# Altium project PCB_Project.PrjPcb
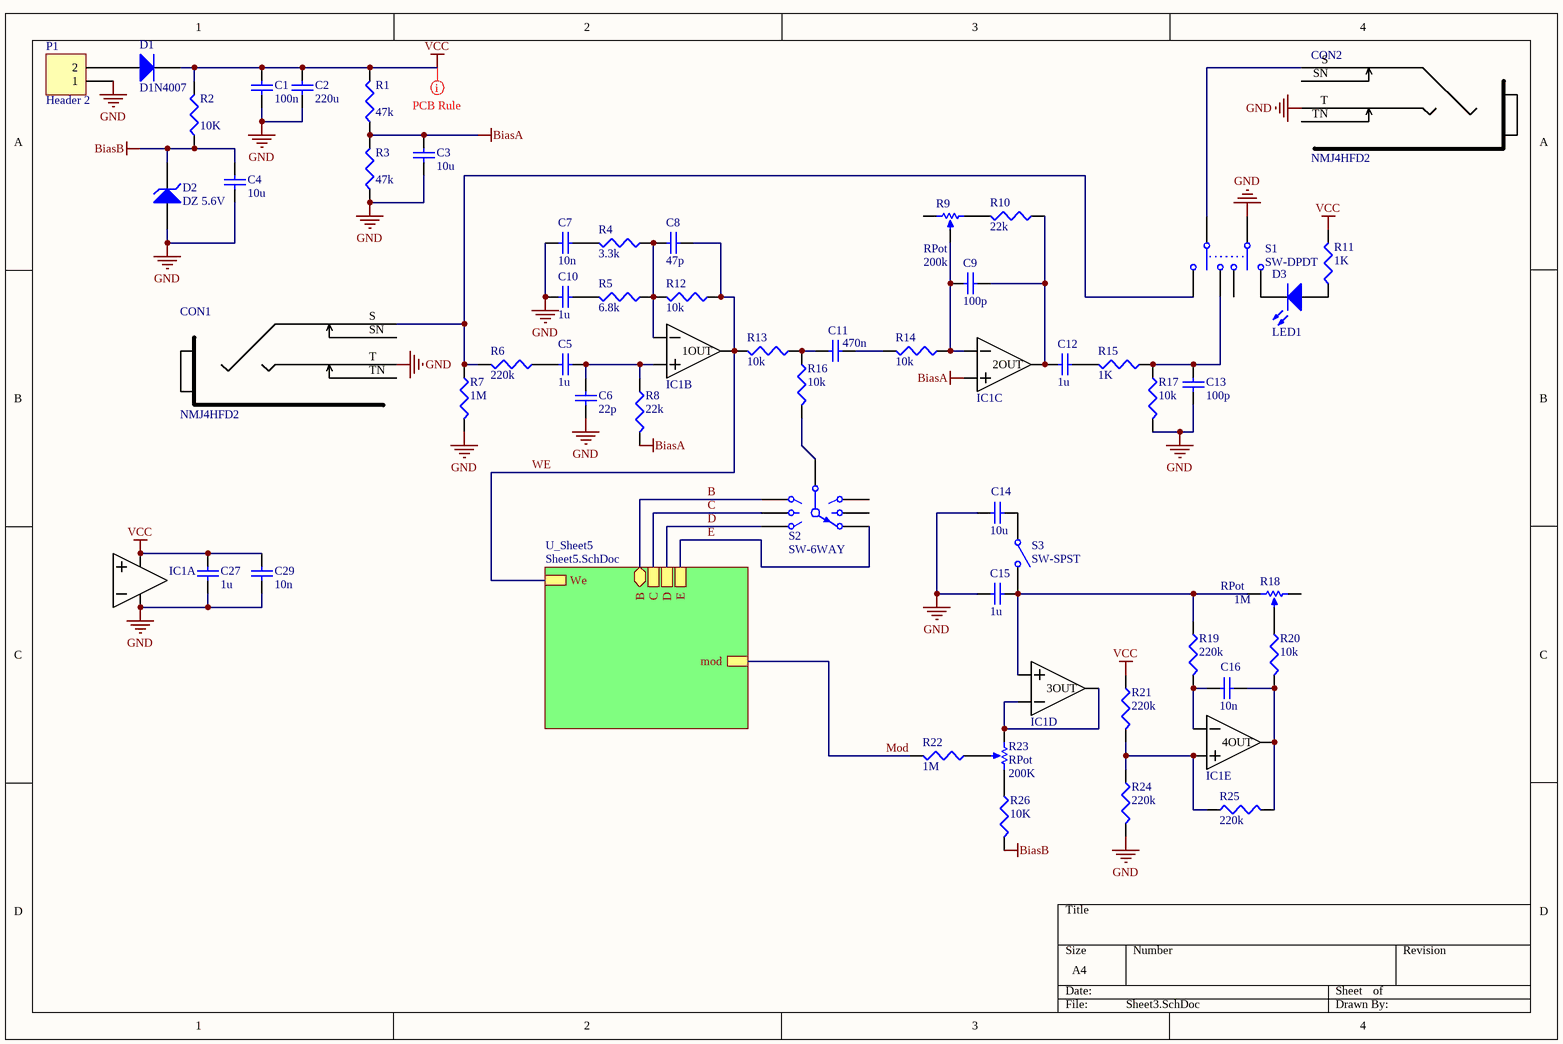
[diagram p0: Sheet3.SchDoc]
2 sheets, 93 parts. Net scope: hierarchical (ports join the sheet entries above them; power ports are global).
Board file: PCB1.PcbDoc
Sheets:
  Sheet3.SchDoc
    U_Sheet5 = Sheet5.SchDoc

## Sheet Sheet3.SchDoc
size A4

### Parts
C1  value 100n  [C1206]  (hidden comment: Cap Semi)
C2  value 220u  [C1206]  (hidden comment: Cap Semi)
C3  value 10u  [C1206]  (hidden comment: Cap Semi)
C4  value 10u  [C1206]  (hidden comment: Cap Semi)
C5  value 1u  [C1206]  (hidden comment: Cap Semi)
C6  value 22p  [C1206]  (hidden comment: Cap Semi)
C7  value 10n  [C1206]  (hidden comment: Cap Semi)
C8  value 47p  [C1206]  (hidden comment: Cap Semi)
C9  value 100p  [C1206]  (hidden comment: Cap Semi)
C10  value 1u  [C1206]  (hidden comment: Cap Semi)
C11  value 470n  [C1206]  (hidden comment: Cap Semi)
C12  value 1u  [C1206]  (hidden comment: Cap Semi)
C13  value 100p  [C1206]  (hidden comment: Cap Semi)
C14  value 10u  [C1206]  (hidden comment: Cap Semi)
C15  value 1u  [C1206]  (hidden comment: Cap Semi)
C16  value 10n  [C1206]  (hidden comment: Cap Semi)
C27  value 1u  [C1206]  (hidden comment: Cap Semi)
C29  value 10n  [C1206]  (hidden comment: Cap Semi)
CON1  NMJ4HFD2  [NMJ4HFD2]
CON2  NMJ4HFD2  [NMJ4HFD2]
D1  D1N4007  [DO-41]
D2  DZ 5.6V  [DIODE-0.7]
D3  LED1  [LED-1]
IC1  TL074A  [TL074A]  (value not drawn)  (parts A,B,C,D,E of 5)
P1  Header 2  [HDR1X2]
R1  value 47k  [J1-0603]  (hidden comment: Res3)
R2  value 10K  [J1-0603]  (hidden comment: Res3)
R3  value 47k  [J1-0603]  (hidden comment: Res3)
R4  value 3.3k  [J1-0603]  (hidden comment: Res3)
R5  value 6.8k  [J1-0603]  (hidden comment: Res3)
R6  value 220k  [J1-0603]  (hidden comment: Res3)
R7  value 1M  [J1-0603]  (hidden comment: Res3)
R8  value 22k  [J1-0603]  (hidden comment: Res3)
R9  RPot  value 200k  [VR5]
R10  value 22k  [J1-0603]  (hidden comment: Res3)
R11  value 1K  [J1-0603]  (hidden comment: Res3)
R12  value 10k  [J1-0603]  (hidden comment: Res3)
R13  value 10k  [J1-0603]  (hidden comment: Res3)
R14  value 10k  [J1-0603]  (hidden comment: Res3)
R15  value 1K  [J1-0603]  (hidden comment: Res3)
R16  value 10k  [J1-0603]  (hidden comment: Res3)
R17  value 10k  [J1-0603]  (hidden comment: Res3)
R18  RPot  value 1M  [VR5]
R19  value 220k  [J1-0603]  (hidden comment: Res3)
R20  value 10k  [J1-0603]  (hidden comment: Res3)
R21  value 220k  [J1-0603]  (hidden comment: Res3)
R22  value 1M  [J1-0603]  (hidden comment: Res3)
R23  RPot  value 200K  [VR5]
R24  value 220k  [J1-0603]  (hidden comment: Res3)
R25  value 220k  [J1-0603]  (hidden comment: Res3)
R26  value 10K  [J1-0603]  (hidden comment: Res3)
S1  SW-DPDT  [DPDT-6]
S2  SW-6WAY  [SW-7]
S3  SW-SPST  [SPST-2]

### Sub-sheets
U_Sheet5 = Sheet5.SchDoc: We, B (bidir), C, D, E, mod

### Nets
BiasA: C3.2 IC1.5(2IN+) R1.1 R3.2 R8.2
BiasB: C4.2 D2.2(K) R2.1 R26.2
GND: C1.1 C2.1 C3.1 C4.1 C6.2 C7.2 C10.2 C13.2 C14.1 C15.1 C27.1 C29.1 CON1.T CON2.T D2.1(A) IC1.11(VCC-) P1.1 R3.1 R7.2 R17.2 R24.2 S1.1
VCC: C1.2 C2.2 C27.2 C29.2 D1.2(K) IC1.4(VCC+) R1.2 R2.2 R11.2 R21.1
B: S2.1 ; sheet U_Sheet5/B
C: S2.2 ; sheet U_Sheet5/C
D: S2.3 ; sheet U_Sheet5/D
E: S2.6 ; sheet U_Sheet5/E
Mod: R22.2 ; sheet U_Sheet5/mod
WE: C8.1 IC1.1(1OUT) R12.1 R13.2 ; sheet U_Sheet5/We
NetC5_1: C5.1 C6.1 IC1.3(1IN+) R8.1
NetC5_2: C5.2 R6.1
NetC7_1: C7.1 R4.2
NetC8_2: C8.2 IC1.2(1IN-) R4.1 R5.1 R12.2
NetC9_1: C9.1 C12.2 IC1.7(2OUT) R10.1
NetC9_2: C9.2 IC1.6(2IN-) R9.3(TAP) R14.1
NetC10_1: C10.1 R5.2
NetC11_1: C11.1 R14.2
NetC11_2: C11.2 R13.1 R16.1
NetC12_1: C12.1 R15.2
NetC13_1: C13.1 R15.1 R17.1 S1.5
NetC14_2: C14.2 S3.1(COMMON)
NetC15_2: C15.2 IC1.10(3IN+) R18.1(TOP) R19.1 S3.2(NO)
NetC16_1: C16.1 IC1.13(4IN-) R19.2
NetC16_2: C16.2 IC1.14(4OUT) R20.2 R25.2
NetCON1_S: CON1.S R6.2 R7.1 S1.6
NetCON2_S: CON2.S S1.4
NetD1_1: D1.1(A) P1.2
NetD3_1: D3.1(A) R11.1
NetD3_2: D3.2(K) S1.2
NetIC1_8: IC1.8(3OUT) IC1.9(3IN-) R23.1(TOP)
NetIC1_12: IC1.12(4IN+) R21.2 R24.1 R25.1
NetR9_2: R9.2(BOT) R10.2
NetR16_2: R16.2 S2.7
NetR18_3: R18.3(TAP) R20.1
NetR22_1: R22.1 R23.3(TAP)
NetR23_2: R23.2(BOT) R26.1

Not connected (* = marked no-connect by the designer): CON1 SN TN; CON2 SN TN; R9 1(TOP); R18 2(BOT); S1 3; S2 4 5

### Layout directives
rule Width Constraint [Pref Width = 20mil    Min Width = 15mil    Max Width = 30mil]: VCC

### Library data of the parts
C1-C16 C27 C29 = Cap Semi: Capacitor (Semiconductor SIM Model); Published: 8-Jun-2000; LatestRevisionDate: 29-May-2009; LatestRevisionNote: IPC-7351 Footprint Added.; PackageReference: C1206; Publisher: Altium Limited; PackageDescription: Chip Capacitor
CON1 CON2 = NMJ4HFD2: 1/4" jack connector; helpURL: http://www.neutrik.com/en/audio/plugs-and-jacks/m-series/nmj4hfd2; Supplier 1: Farnell; Supplier 2: Mouser; Supplier 3: Newark; Supplier 4: Allied Electronics; Supplier Part Number 1: 4169244; Supplier Part Number 2: 550-10201; Supplier Part Number 3: 14J4924; Supplier Part Number 4: 70549221
D1 = Diode 1N4007: 1 Amp General Purpose Rectifier; Published: 8-Jun-2000; LatestRevisionDate: 17-Jul-2002; LatestRevisionNote: Re-released for DXP Platform.; DatasheetVersion: 1998; PackageVersion: Aug-1999; PackageReference: DO-41; Publisher: Altium Limited; PackageDescription: Diode, Axial; Body 5.2 x 2.7 mm (LxDia. max), Lead Dia. 0.86 mm (max); Code_JEDEC: DO-204-AL; ComponentLink1Description: Manufacturer Link; ComponentLink1URL: http://www.fairchildsemi.com/; ComponentLink2Description: Datasheet; ComponentLink2URL: http://www.fairchildsemi.com/ds/1N%2F1N4001.pdf
D2 = D Zener: Zener Diode; Published: 8-Jun-2000; LatestRevisionDate: 17-Jul-2002; LatestRevisionNote: Re-released for DXP Platform.; PackageReference: DIODE-0.7; Publisher: Altium Limited; PackageDescription: Diode, Thru-Hole; 2 Leads; 0.7 in Pin Spacing
D3 = LED1: Typical RED GaAs LED; Published: 8-Jun-2000; LatestRevisionDate: 08-Jul-2005; LatestRevisionNote: Mech Layer 1 removed.; PackageReference: LED-1; Publisher: Altium Limited; PackageDescription: LED; 2 Leads
IC1 = TL074A: TL074A Op-Amp; helpURL: http://www.ti.com/general/docs/lit/getliterature.tsp?genericPartNumber=tl074&fileType=pdf; Supplier 1: Digi-Key; Supplier 2: Farnell; Supplier 3: Mouser; Supplier 4: Newark; Supplier 5: Arrow; Supplier 6: Arrow; Supplier 7: Newark; Supplier Part Number 1: 296-14998-1-ND; Supplier Part Number 2: 9593349; Supplier Part Number 3: 595-TL074ACDR; Supplier Part Number 4: 98K1644; Supplier Part Number 5: TL074ACDR; Supplier Part Number 6: TL074ACDR**MULT1; Supplier Part Number 7: 85X7487
P1 = Header 2: Header, 2-Pin; LatestRevisionDate: 17-Jul-2002; LatestRevisionNote: Re-released for DXP Platform.; Publisher: Altium Limited
R1-R8 R10-R17 R19-R22 R24-R26 = Res3: Resistor; Published: 8-Jun-2000; LatestRevisionDate: 29-May-2009; LatestRevisionNote: IPC-7351 Footprint Added.; PackageReference: J1-0603; Publisher: Altium Limited; PackageDescription: Chip Resistor
R9 R18 R23 = RPot: Potentiometer; Sim Note: Enter the Resistance value and the set point into parameter fields.; Set Position: 0.5; Published: 8-Jun-2000; LatestRevisionDate: 17-Jul-2002; LatestRevisionNote: Re-released for DXP Platform.; PackageReference: VR5; Publisher: Altium Limited; PackageDescription: Variable Resistor, Thru-Hole; 3 Leads
S1 = SW-DPDT: Double-Pole, Double-Throw Switch; Published: 24-Mar-1999; LatestRevisionDate: 17-Jul-2002; LatestRevisionNote: Re-released for DXP Platform.; PackageReference: DPDT-6; Publisher: Altium Limited; PackageDescription: Switch; 6 Leads
S2 = SW-6WAY: 6 Way Switch; Published: 24-Mar-1999; LatestRevisionDate: 17-Jul-2002; LatestRevisionNote: Re-released for DXP Platform.; PackageReference: SW-7; Publisher: Altium Limited; PackageDescription: Switch; 7 Leads
S3 = SW-SPST: Single-Pole, Single-Throw Switch; Published: 24-Mar-1999; LatestRevisionDate: 17-Jul-2002; LatestRevisionNote: Re-released for DXP Platform.; PackageReference: SPST-2; Publisher: Altium Limited; PackageDescription: Switch; 2 Leads

## Sheet Sheet5.SchDoc
size A4
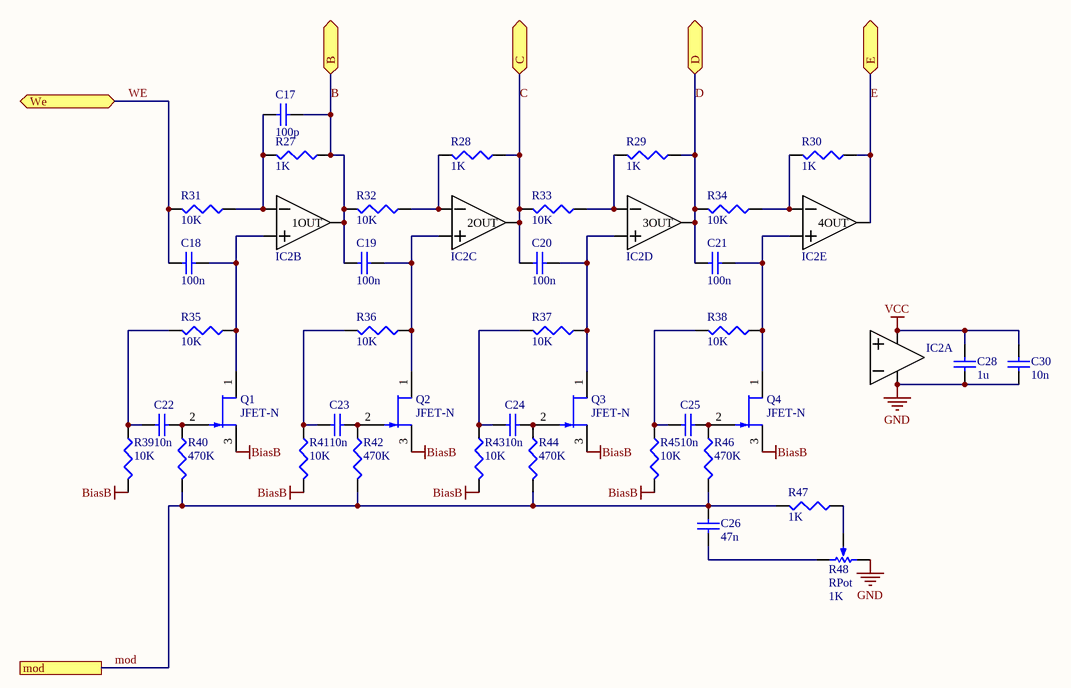
[diagram p1: Sheet5.SchDoc]

### Parts
C17  value 100p  [C1206]  (hidden comment: Cap Semi)
C18  value 100n  [C1206]  (hidden comment: Cap Semi)
C19  value 100n  [C1206]  (hidden comment: Cap Semi)
C20  value 100n  [C1206]  (hidden comment: Cap Semi)
C21  value 100n  [C1206]  (hidden comment: Cap Semi)
C22  value 10n  [C1206]  (hidden comment: Cap Semi)
C23  value 10n  [C1206]  (hidden comment: Cap Semi)
C24  value 10n  [C1206]  (hidden comment: Cap Semi)
C25  value 10n  [C1206]  (hidden comment: Cap Semi)
C26  value 47n  [C1206]  (hidden comment: Cap Semi)
C28  value 1u  [C1206]  (hidden comment: Cap Semi)
C30  value 10n  [C1206]  (hidden comment: Cap Semi)
IC2  TL074A  [TL074A]  (value not drawn)  (parts A,B,C,D,E of 5)
Q1  JFET-N  [TO-254-AA]
Q2  JFET-N  [TO-254-AA]
Q3  JFET-N  [TO-254-AA]
Q4  JFET-N  [TO-254-AA]
R27  value 1K  [J1-0603]  (hidden comment: Res3)
R28  value 1K  [J1-0603]  (hidden comment: Res3)
R29  value 1K  [J1-0603]  (hidden comment: Res3)
R30  value 1K  [J1-0603]  (hidden comment: Res3)
R31  value 10K  [J1-0603]  (hidden comment: Res3)
R32  value 10K  [J1-0603]  (hidden comment: Res3)
R33  value 10K  [J1-0603]  (hidden comment: Res3)
R34  value 10K  [J1-0603]  (hidden comment: Res3)
R35  value 10K  [J1-0603]  (hidden comment: Res3)
R36  value 10K  [J1-0603]  (hidden comment: Res3)
R37  value 10K  [J1-0603]  (hidden comment: Res3)
R38  value 10K  [J1-0603]  (hidden comment: Res3)
R39  value 10K  [J1-0603]  (hidden comment: Res3)
R40  value 470K  [J1-0603]  (hidden comment: Res3)
R41  value 10K  [J1-0603]  (hidden comment: Res3)
R42  value 470K  [J1-0603]  (hidden comment: Res3)
R43  value 10K  [J1-0603]  (hidden comment: Res3)
R44  value 470K  [J1-0603]  (hidden comment: Res3)
R45  value 10K  [J1-0603]  (hidden comment: Res3)
R46  value 470K  [J1-0603]  (hidden comment: Res3)
R47  value 1K  [J1-0603]  (hidden comment: Res3)
R48  RPot  value 1K  [VR5]

### Ports
B (bidir), C, D, E, mod, We

### Nets
BiasB: Q1.3(S) Q2.3(S) Q3.3(S) Q4.3(S) R39.2 R41.2 R43.2 R45.2
GND: C28.2 C30.2 IC2.11(VCC-) R48.1(TOP)
VCC: C28.1 C30.1 IC2.4(VCC+)
B: C17.1 C19.2 IC2.1(1OUT) R27.1 R32.2 ; port B
C: C20.2 IC2.7(2OUT) R28.1 R33.2 ; port C
D: C21.2 IC2.8(3OUT) R29.1 R34.2 ; port D
E: IC2.14(4OUT) R30.1 ; port E
Mod: C26.1 R40.2 R42.2 R44.2 R46.2 R47.2 ; port mod
WE: C18.2 R31.2 ; port We
NetC17_2: C17.2 IC2.2(1IN-) R27.2 R31.1
NetC18_1: C18.1 IC2.3(1IN+) Q1.1(D) R35.1
NetC19_1: C19.1 IC2.5(2IN+) Q2.1(D) R36.1
NetC20_1: C20.1 IC2.10(3IN+) Q3.1(D) R37.1
NetC21_1: C21.1 IC2.12(4IN+) Q4.1(D) R38.1
NetC22_1: C22.1 Q1.2(G) R40.1
NetC22_2: C22.2 R35.2 R39.1
NetC23_1: C23.1 Q2.2(G) R42.1
NetC23_2: C23.2 R36.2 R41.1
NetC24_1: C24.1 Q3.2(G) R44.1
NetC24_2: C24.2 R37.2 R43.1
NetC25_1: C25.1 Q4.2(G) R46.1
NetC25_2: C25.2 R38.2 R45.1
NetC26_2: C26.2 R48.2(BOT)
NetIC2_6: IC2.6(2IN-) R28.2 R32.1
NetIC2_9: IC2.9(3IN-) R29.2 R33.1
NetIC2_13: IC2.13(4IN-) R30.2 R34.1
NetR47_1: R47.1 R48.3(TAP)

### Library data of the parts
C17-C26 C28 C30 = Cap Semi: Capacitor (Semiconductor SIM Model); Published: 8-Jun-2000; LatestRevisionDate: 29-May-2009; LatestRevisionNote: IPC-7351 Footprint Added.; PackageReference: C1206; Publisher: Altium Limited; PackageDescription: Chip Capacitor
IC2 = TL074A: TL074A Op-Amp; helpURL: http://www.ti.com/general/docs/lit/getliterature.tsp?genericPartNumber=tl074&fileType=pdf; Supplier 1: Digi-Key; Supplier 2: Farnell; Supplier 3: Mouser; Supplier 4: Newark; Supplier 5: Arrow; Supplier 6: Arrow; Supplier 7: Newark; Supplier Part Number 1: 296-14998-1-ND; Supplier Part Number 2: 9593349; Supplier Part Number 3: 595-TL074ACDR; Supplier Part Number 4: 98K1644; Supplier Part Number 5: TL074ACDR; Supplier Part Number 6: TL074ACDR**MULT1; Supplier Part Number 7: 85X7487
Q1-Q4 = JFET-N: N-Channel JFET; Published: 8-Jun-2000; LatestRevisionDate: 17-Jul-2002; LatestRevisionNote: Re-released for DXP Platform.; PackageReference: TO-254-AA; Publisher: Altium Limited; Code_JEDEC: TO-254-AA
R27-R47 = Res3: Resistor; Published: 8-Jun-2000; LatestRevisionDate: 29-May-2009; LatestRevisionNote: IPC-7351 Footprint Added.; PackageReference: J1-0603; Publisher: Altium Limited; PackageDescription: Chip Resistor
R48 = RPot: as R9 on sheet Sheet3; Published: 8-Jun-2000; LatestRevisionDate: 17-Jul-2002; LatestRevisionNote: Re-released for DXP Platform.; PackageReference: VR5; Publisher: Altium Limited; PackageDescription: Variable Resistor, Thru-Hole; 3 Leads

## Nets that join several sheets
BiasB: Sheet3 (C4.2 D2.2 R2.1 R26.2), Sheet5 (8 pins)
GND: Sheet3 (22 pins), Sheet5 (C28.2 C30.2 IC2.11 R48.1)
VCC: Sheet3 (10 pins), Sheet5 (C28.1 C30.1 IC2.4)
B: Sheet3 (S2.1), Sheet5 (5 pins)
C: Sheet3 (S2.2), Sheet5 (C20.2 IC2.7 R28.1 R33.2)
D: Sheet3 (S2.3), Sheet5 (C21.2 IC2.8 R29.1 R34.2)
E: Sheet3 (S2.6), Sheet5 (IC2.14 R30.1)
Mod: Sheet3 (R22.2), Sheet5 (6 pins)
WE: Sheet3 (C8.1 IC1.1 R12.1 R13.2), Sheet5 (C18.2 R31.2)